# EAGLE design scd_v2 (EAGLE 8.4.3)
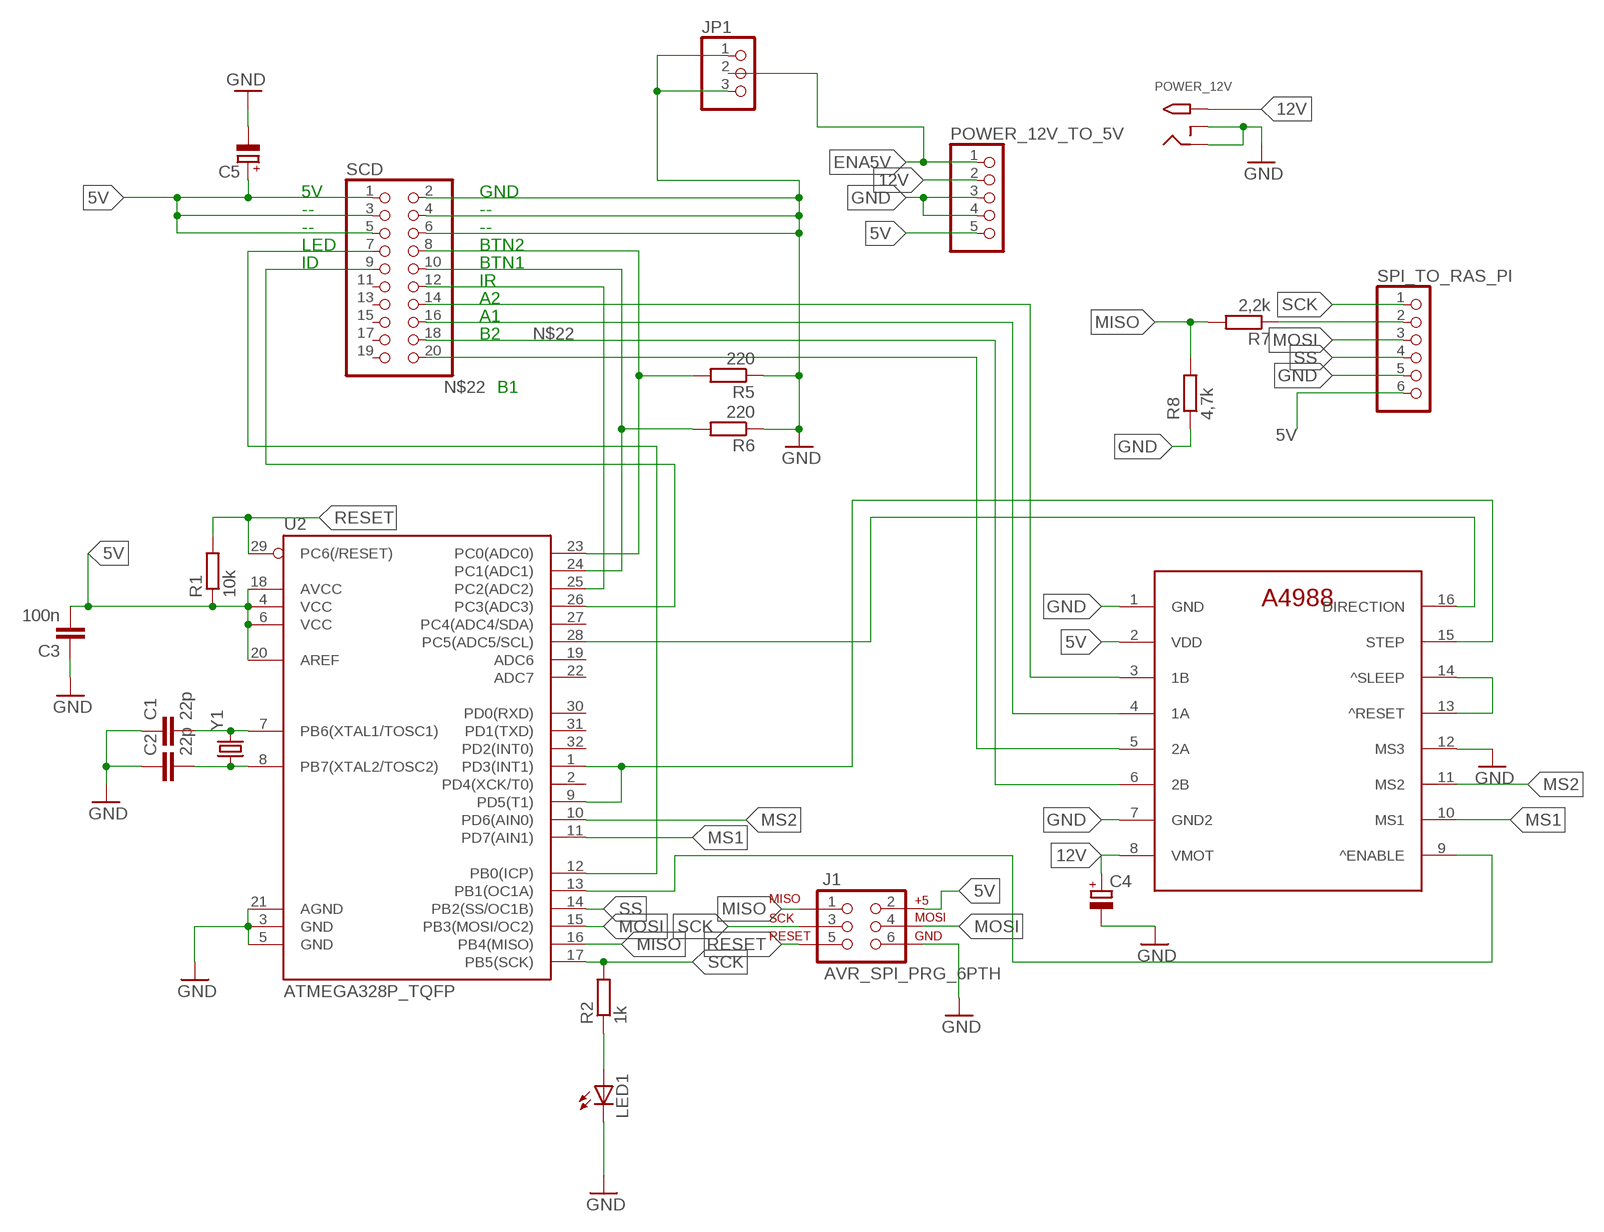
[diagram p0: schematic, sheet 1]

## Parts
C1  22p  C-EUC0805  [C0805]
C2  22p  C-EUC0805  [C0805]
C3  100n  C-EUC0805  [C0805]
C4  CPOL-EUTT2D7  [TT2D7]
C5  CPOL-EUTT2D7  [TT2D7]
J1  AVR_SPI_PRG_6PTH  [2X3]
JP1  PINHD-1X3/90  [1X03/90]
LED1  LEDCHIP-LED0805  [CHIP-LED0805]
POWER_12V  2.1MMJACKTHM  [PJ-102A]
POWER_12V_TO_5V  PINHD-1X5_2.54  [1X05]
R1  10k  R-EU_R0805  [R0805]
R2  1k  R-EU_R0805  [R0805]
R5  220  R-EU_R0805  [R0805]
R6  220  R-EU_R0805  [R0805]
R7  2,2k  R-EU_R0805  [R0805]
R8  4,7k  R-EU_R0805  [R0805]
SCD  PINHD-2X10_2.54  [2X10]
SPI_TO_RAS_PI  PINHD-1X6  [1X06]
U2  ATMEGA328P_TQFP  [TQFP32-08]
U$1  A4998_BREAKOUT  [A4988_BREAKOUT]
Y1  CRYSTALSMD  [HC49UP]

## Nets
5V: C3.2 C5.+ J1.2 POWER_12V_TO_5V.5 R1.1 SCD.1 SCD.3 SCD.5 SPI_TO_RAS_PI.6 U2.4(VCC) U2.6(VCC) U2.18(AVCC) U2.20(AREF) U$1.2(VDD)
12V: C4.+ POWER_12V.TIP POWER_12V_TO_5V.2 U$1.8(VMOT)
ENA5V: JP1.2 POWER_12V_TO_5V.1
GND: C1.1 C2.1 C3.1 C4.- C5.- J1.6 JP1.1 JP1.3 LED1.C POWER_12V.RING POWER_12V.RING_SW POWER_12V_TO_5V.3 POWER_12V_TO_5V.4 R5.1 R6.1 R8.1 SCD.2 SCD.4 SCD.6 SPI_TO_RAS_PI.5 U2.3(GND) U2.5(GND) U2.21(AGND) U$1.7(GND2) U$1.12(MS3)
MISO: J1.1 R7.2 R8.2 U2.16(PB4(MISO))
MOSI: J1.4 SPI_TO_RAS_PI.3 U2.15(PB3(MOSI/OC2))
MS1: U2.11(PD7(AIN1)) U$1.10(MS1)
MS2: U2.10(PD6(AIN0)) U$1.11(MS2)
N$1: SCD.20 U$1.5(2A)
N$2: R7.1 SPI_TO_RAS_PI.2
N$5: U2.1(PD3(INT1)) U2.9(PD5(T1)) U$1.15(STEP)
N$6: LED1.A R2.1
N$8: C1.2 U2.7(PB6(XTAL1/TOSC1)) Y1.2
N$9: C2.2 U2.8(PB7(XTAL2/TOSC2)) Y1.1
N$12: U2.13(PB1(OC1A)) U$1.9(^ENABLE)
N$13: SCD.7 U2.12(PB0(ICP))
N$14: U2.28(PC5(ADC5/SCL)) U$1.16(DIRECTION)
N$15: U$1.13(^RESET) U$1.14(^SLEEP)
N$16: R5.2 SCD.8 U2.23(PC0(ADC0))
N$17: R6.2 SCD.10 U2.24(PC1(ADC1))
N$18: SCD.12 U2.25(PC2(ADC2))
N$19: SCD.9 U2.26(PC3(ADC3))
N$20: SCD.14 U$1.3(1B)
N$21: SCD.16 U$1.4(1A)
N$22: SCD.18 U$1.6(2B)
RESET: J1.5 R1.2 U2.29(PC6(/RESET))
SCK: J1.3 R2.2 SPI_TO_RAS_PI.1 U2.17(PB5(SCK))
SS: SPI_TO_RAS_PI.4 U2.14(PB2(SS/OC1B))
Unconnected: SCD.11 SCD.13 SCD.15 SCD.17 SCD.19 U2.2(PD4(XCK/T0)) U2.19(ADC6) U2.22(ADC7) U2.27(PC4(ADC4/SDA)) U2.30(PD0(RXD)) U2.31(PD1(TXD)) U2.32(PD2(INT0)) U$1.1(GND)

## Notes on the sheet
- 5V | GND
- -- | --
- -- | --
- LED | BTN2
- ID | BTN1
- IR
- A2
- A1
- B2
- B1

## Library data of the parts
C1-C3 = rcl:C-EU: CAPACITOR, European symbol
C4 C5 = resistor:CPOL-EU: POLARIZED CAPACITOR, European symbol
J1 = SparkFun-Connectors:AVR_SPI_PRG_6: AVR ISP 6 Pin This is the reduced ISP connector for AVR programming. Common on Arduino. This footprint will take up less PCB space and can be used with a 10-pin to 6-pin adapter such as SKU: BOB-08508 **Special note about "TEST_POINT" package. The stop mask is on the top side, so if you want your programming test points to be on the bottom of your board, make sure to place this package on the bottom side of the board. This also ensure that the orientation to program from the bottom side will be correct.
JP1 = pinhead:PINHD-1X3: PIN HEADER
LED1 = adafruit:LED: LED OSRAM: - CHIPLED LG R971, LG N971, LY N971, LG Q971, LY Q971, LO R971, LY R971 LH N974, LH R974 LS Q976, LO Q976, LY Q976 LO Q996 - Hyper CHIPLED LW Q18S LB Q993, LB Q99A, LB R99A - SideLED LS A670, LO A670, LY A670, LG A670, LP A670 LB A673, LV A673, LT A673, LW A673 LH A674 LY A675 LS A676, LA A676, LO A676, LY A676, LW A676 LS A679, LY A679, LG A679 - Hyper Micro SIDELED® LS Y876, LA Y876, LO Y876, LY Y876 LT Y87S - SmartLED LW L88C, LW L88S LB L89C, LB L89S, LG L890 LS L89K, LO L89K, LY L89K LS L896, LA L896, LO L896, LY L896 - TOPLED LS T670, LO T670, LY T670, LG T670, LP T670 LSG T670, LSP T670, LSY T670, LOP T670, LYG T670 LG T671, LOG T671, LSG T671 LB T673, LV T673, LT T673, LW T673 LH T674 LS T676, LA T676, LO T676, LY T676, LB T676, LH T676, LSB T676, LW T676 LB T67C, LV T67C, LT T67C, LS T67K, LO T67K, LY T67K, LW E67C LS E67B, LA E67B, LO E67B, LY E67B, LB E67C, LV E67C, LT E67C LW T67C LS T679, LY T679, LG T679 LS T770, LO T770, LY T770, LG T770, LP T770 LB T773, LV T773, LT T773, LW T773 LH T774 LS E675, LA E675, LY E675, LS T675 LS T776, LA T776, LO T776, LY T776, LB T776 LHGB T686 LT T68C, LB T68C - Hyper Mini TOPLED® LB M676 - Mini TOPLED Santana® LG M470 LS M47K, LO M47K, LY M47K Source: http://www.osram.convergy.de/
POWER_12V = adafruit:2.1MMJACK: 2.1mm x 5.5mm THM DC jack with internal switch. Digikey part #PJ-102A, 4UCON part #05537 2.1mm x 5.5mm SMT DC jack with internal switch. Digikey part #PJ-002A-SMT, 4UCON part #03267 By microbuilder.eu & adafruit.com
POWER_12V_TO_5V = pinhead2:PINHD-1X5: PIN HEADER
R1 R2 R5-R8 = resistor:R-EU_: RESISTOR, European symbol
SCD = pinhead2:PINHD-2X10: PIN HEADER
SPI_TO_RAS_PI = adafruit:PINHD-1X6: PIN HEADER
U2 = SparkFun-DigitalIC:ATMEGA328P_TQFP; PROD_ID: IC-09069
U$1 = tim:A4998_BREAKOUT
Y1 = SparkFun-FreqCtrl:CRYSTAL: Various standard crystals. Proven footprints.

## Board
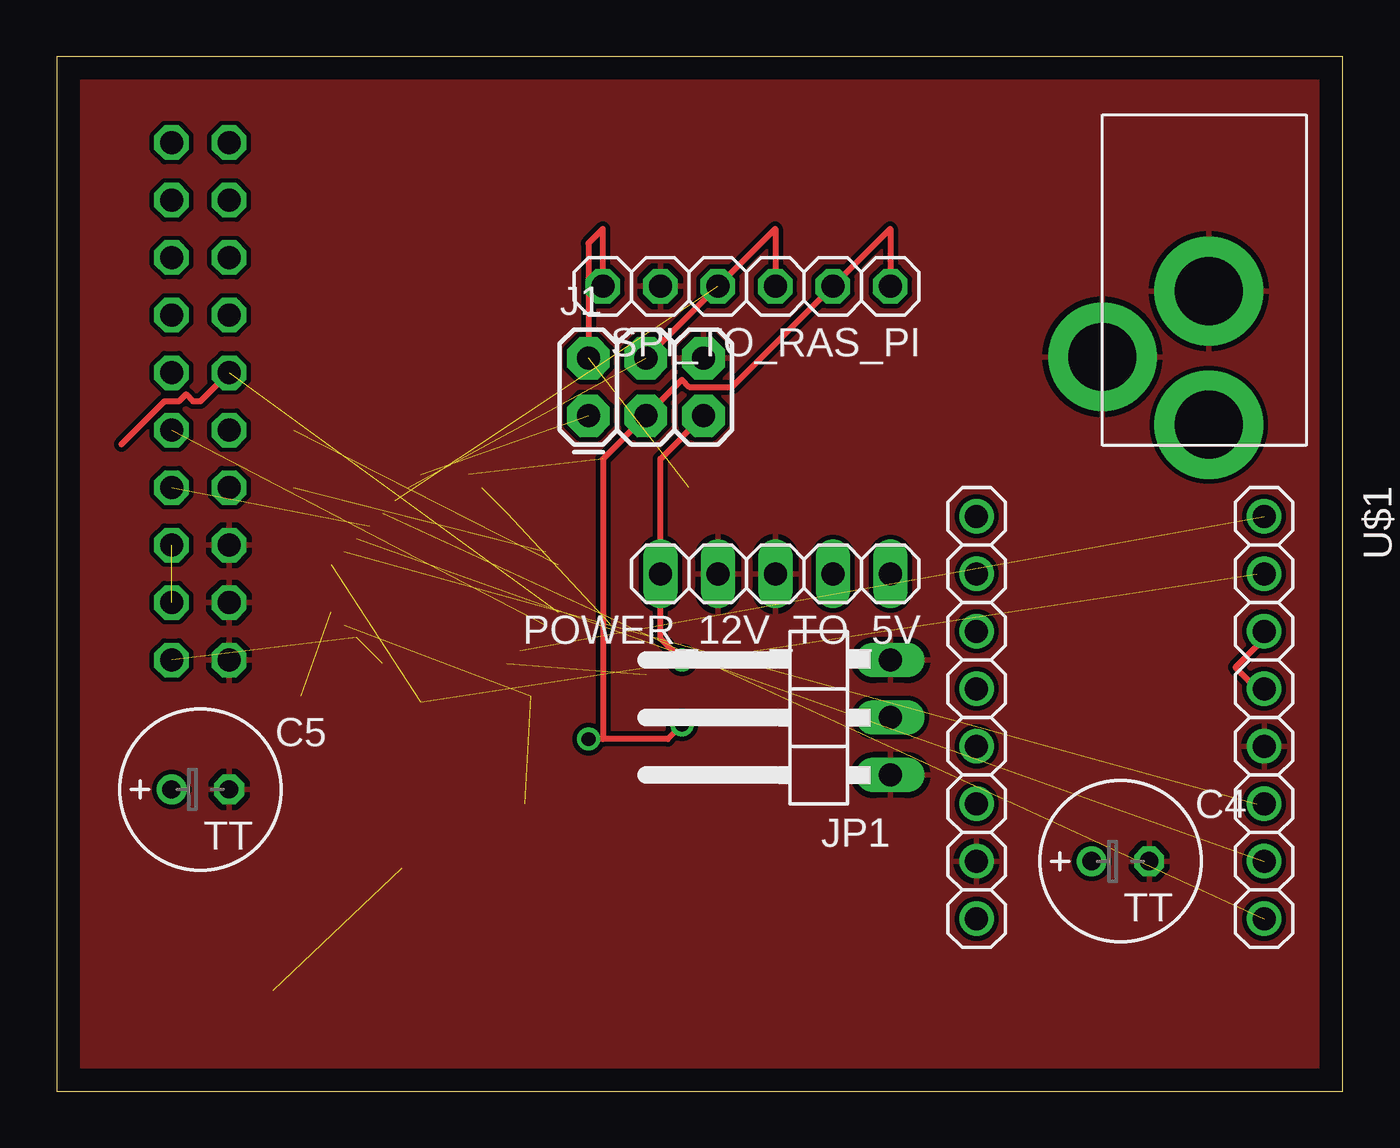
[diagram p1: board, top side]
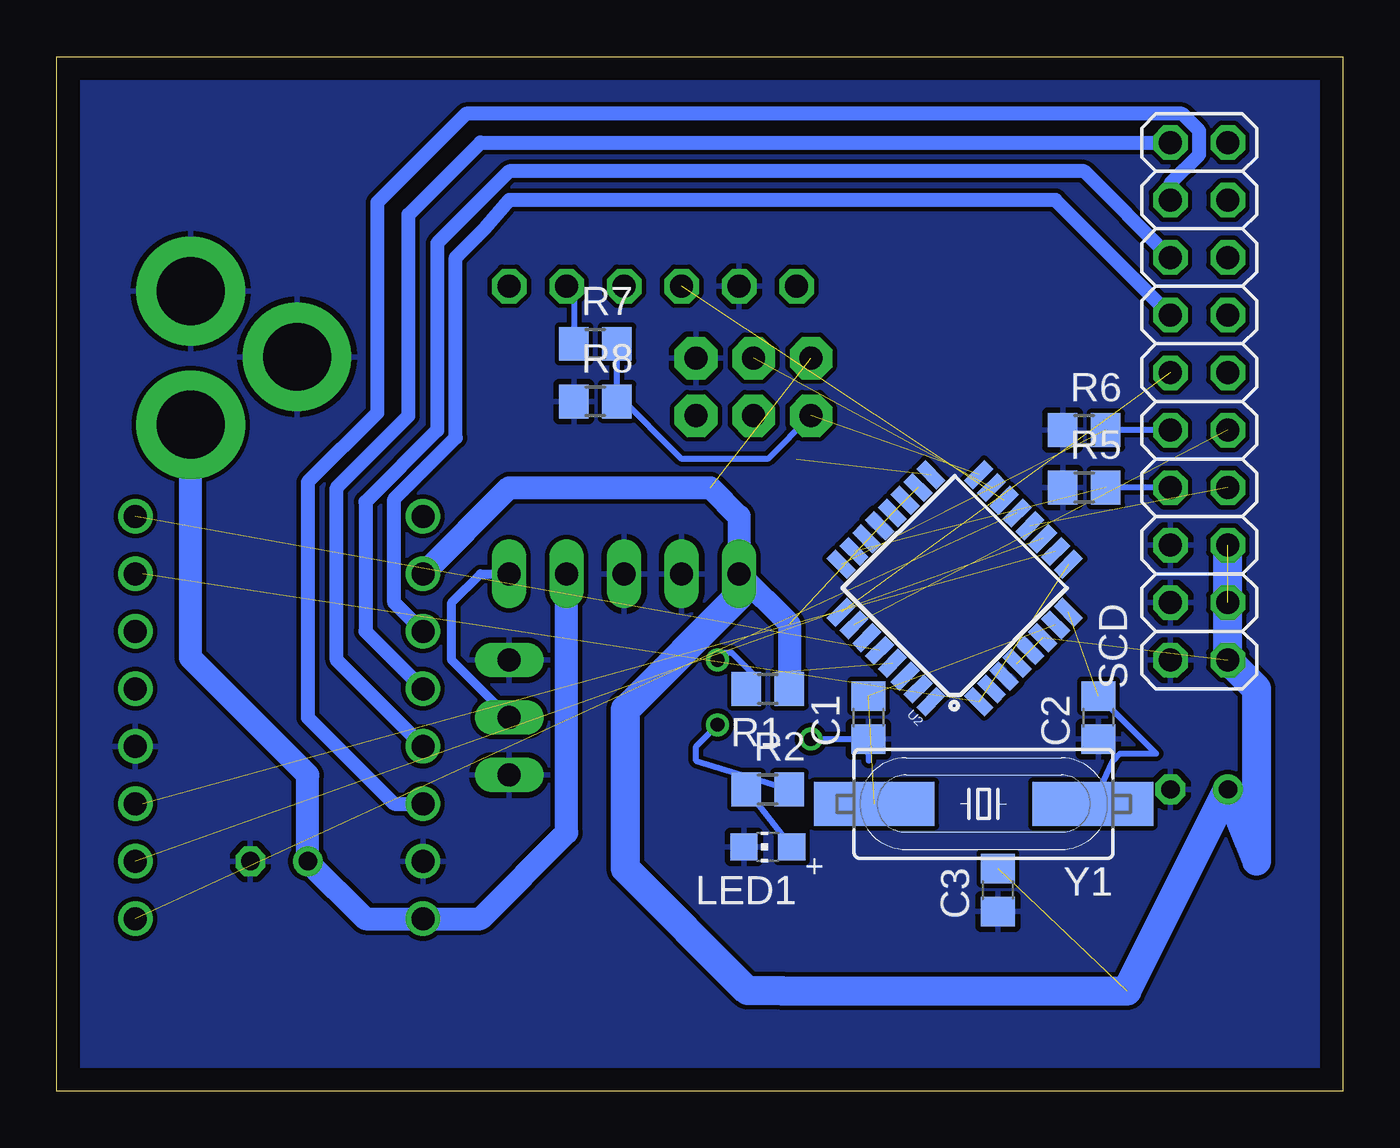
[diagram p2: board, bottom side, seen from below]

Size 56.82 x 45.71 mm. Coordinates in mm from the lower left corner, seen from the top.
Outline: 0,0 56.82,0 56.82,45.71 0,45.71 0,0
Copper layers (1*16): Top 0.035mm / dielectric 1.5mm / Bottom 0.035mm
Design rules "default": minimum track width 10mil, minimum drill 24mil, track to track 8mil, track to pad 8mil, pad to pad 8mil, via to via 8mil, smd to smd 8mil, copper to edge 40mil, drill to drill 8mil, minimum pad ring 10mil, minimum via ring 8mil, stop-mask expansion 4mil, vias tented up to drill 0mil, thermal gap 10mil

### Footprints (pad centres in the part's own frame; a part is rotated, then mirrored left to right if it is on the bottom)
C0805 = smd 1.3 x 1.5: 1 -0.95,0; 2 0.95,0
TT2D7 = drill 0.813: + -1.27,0 | drill 0.813 octagon: - 1.27,0
2X3 = drill 1.016 pad 1.88 octagon: 1 0,0; 2 0,2.54; 3 2.54,0; 4 2.54,2.54; 5 5.08,0; 6 5.08,2.54
1X03/90 = drill 1.016 long: 1 -2.54,-3.81; 2 0,-3.81; 3 2.54,-3.81
CHIP-LED0805 = smd 1.2 x 1.2: A 0,-1.05; C 0,1.05
PJ-102A = drill 3 pad 4.8: RING 0.1,-3.39; RING_SW -4.6,-6.29; TIP 0.1,-9.29
1X05 = drill 1.016 long: 1 -5.08,0; 2 -2.54,0; 3 0,0; 4 2.54,0; 5 5.08,0
R0805 = smd 1.3 x 1.5: 1 -0.95,0; 2 0.95,0
2X10 = drill 1.016 octagon: 1 -11.43,-1.27; 2 -11.43,1.27; 3 -8.89,-1.27; 4 -8.89,1.27; 5 -6.35,-1.27; 6 -6.35,1.27; 7 -3.81,-1.27; 8 -3.81,1.27; 9 -1.27,-1.27; 10 -1.27,1.27; 11 1.27,-1.27; 12 1.27,1.27; 13 3.81,-1.27; 14 3.81,1.27; 15 6.35,-1.27; 16 6.35,1.27; 17 8.89,-1.27; 18 8.89,1.27; 19 11.43,-1.27; 20 11.43,1.27
1X06 = drill 1.016 octagon: 1 -6.35,0; 2 -3.81,0; 3 -1.27,0; 4 1.27,0; 5 3.81,0; 6 6.35,0
TQFP32-08 = smd 1.27 x 0.559: 1 -4.293,2.8; 2 -4.293,2; 3 -4.293,1.2; 4 -4.293,0.4; 5 -4.293,-0.4; 6 -4.293,-1.2; 7 -4.293,-2; 8 -4.293,-2.8; 17 4.293,-2.8; 18 4.293,-2; 19 4.293,-1.2; 20 4.293,-0.4; 21 4.293,0.4; 22 4.293,1.2; 23 4.293,2; 24 4.293,2.8 | smd 0.559 x 1.27: 9 -2.8,-4.293; 10 -2,-4.293; 11 -1.2,-4.293; 12 -0.4,-4.293; 13 0.4,-4.293; 14 1.2,-4.293; 15 2,-4.293; 16 2.8,-4.293; 25 2.8,4.293; 26 2,4.293; 27 1.2,4.293; 28 0.4,4.293; 29 -0.4,4.293; 30 -1.2,4.293; 31 -2,4.293; 32 -2.8,4.293
A4988_BREAKOUT = drill 1.016: 1 1.27,-11.43; 2 3.81,-11.43; 3 6.35,-11.43; 4 8.89,-11.43; 5 11.43,-11.43; 6 13.97,-11.43; 7 16.51,-11.43; 8 19.05,-11.43; 9 19.05,1.27; 10 16.51,1.27; 11 13.97,1.27; 12 11.43,1.27; 13 8.89,1.27; 14 6.35,1.27; 15 3.81,1.27; 16 1.27,1.27
HC49UP = smd 5.334 x 1.93: 1 -4.826,0; 2 4.826,0

### Placement (x,y rotation side)
C1  20.95,16.51 90 bottom
C2  10.79,16.51 90 bottom
C3  15.24,8.89 90 bottom
C4  46.99,10.16 0 top
C5  6.35,13.33 0 top
J1  23.5,29.84 0 top
JP1  33.02,16.51 90 top
LED1  25.4,10.79 90 bottom
POWER_12V  50.8,38.73 0 top
POWER_12V_TO_5V  31.75,22.86 180 top
R1  25.4,17.78 180 bottom
R2  25.4,13.33 0 bottom
R5  11.43,26.67 0 bottom
R6  11.43,29.21 0 bottom
R7  33.02,33.02 0 bottom
R8  33.02,30.48 0 bottom
SCD  6.35,30.48 90 bottom
SPI_TO_RAS_PI  30.48,35.56 180 top
U2  17.14,22.23 135 bottom
U$1  52.07,26.67 270 top
Y1  15.88,12.7 180 bottom

### Tracks (layer width: path | path; a pad name or v marks a point on that pad's centre or on a via)
5V  (7 unrouted)
  Top 0.254: J1.2 23.5,37.46 24.13,38.1 SPI_TO_RAS_PI.6
  Bottom 1.016: U$1.2 36.83,26.67 27.94,26.67 26.67,25.4 POWER_12V_TO_5V.5 24.45,20.64 R1.1
  Bottom 1.27: SCD.5 SCD.1 3.81,17.78 3.81,10.16 C5.+ 9.54,4.43 22.94,4.43 24.86,4.45 | POWER_12V_TO_5V.5 26.67,21.91 31.7,16.88 31.7,9.85 26.3,4.45 24.86,4.45 | 24.77,4.45 24.86,4.45
12V
  Bottom 1.016: POWER_12V.TIP 50.9,19.15 45.72,13.97 C4.+ 43.18,7.62 U$1.8 38.1,7.62 34.29,11.43 POWER_12V_TO_5V.2
ENA5V
  Bottom 0.406: JP1.2 39.37,19.05 39.37,21.59 38.1,22.86 POWER_12V_TO_5V.1
GND
  pour Top: 0,45.72 58.42,45.72 58.42,0 0,0
  pour Bottom: 0,45.72 55.88,45.72 55.88,0 0,0
MISO  (1 unrouted)
  Bottom 0.254: R7.2 32.07,30.8 | 32.07,30.8 R8.2 | 32.07,30.8 29.21,27.94 25.4,27.94 J1.1
MOSI  (1 unrouted)
  Top 0.254: SPI_TO_RAS_PI.3 31.75,38.1 J1.4
MS1  (1 unrouted)
MS2  (1 unrouted)
  Bottom 0.254: 53.02,12.7 U$1.11
N$1
  Bottom 0.61: U$1.5 44.45,19.05 44.45,26.67 41.27,29.84 41.27,38.73 38.1,41.91 SCD.20
N$2
  Bottom 0.254: SPI_TO_RAS_PI.2 33.97,35.24 33.97,35.56 R7.1
N$5  (2 unrouted)
  Bottom 0.254: U$1.15 53.02,22.86
N$6
  Bottom 0.254: R2.1 LED1.A
N$8  (2 unrouted)
N$9  (1 unrouted)
  Bottom 0.254: C2.2 8.26,14.92 9.84,14.92 10.16,14.6 Y1.1
N$12  (1 unrouted)
N$13  (1 unrouted)
N$14  (1 unrouted)
N$15
  Top 0.254: U$1.13 53.02,17.78 52.07,18.73 53.34,20 U$1.14
N$16  (1 unrouted)
  Bottom 0.254: SCD.8 R5.2
N$17  (1 unrouted)
  Bottom 0.254: SCD.10 R6.2
N$18  (1 unrouted)
  Top 0.254: 2.86,28.57 4.76,30.48 5.4,30.48 5.71,30.8 6.03,30.48 6.35,30.48 SCD.12
N$19  (1 unrouted)
N$20
  Bottom 0.61: SCD.14 12.7,39.37 36.83,39.37 37.92,38.1 39.19,36.83 39.19,28.87 41.91,26.16 41.91,21.59 U$1.3
N$21
  Bottom 0.61: U$1.4 43.18,20.32 43.18,26.03 40.01,29.21 40.01,37.46 36.83,40.64 11.43,40.64 SCD.16
N$22
  Bottom 0.61: SCD.18 7.62,40.11 6.35,41.38 6.35,42.44 7.09,43.18 38.73,43.18 42.66,39.26 42.66,29.97 45.72,26.91 45.72,16.51 41.91,12.7 U$1.6
RESET  (via drill 0.61)  (1 unrouted)
  Top 0.254: J1.5 26.67,27.94 26.67,20 v27.62,19.05
  Bottom 0.254: v27.62,19.05 27.3,19.37 26.99,19.37 26.04,18.41 26.04,17.78 R1.2
SCK  (via drill 0.61)  (1 unrouted)
  Top 0.254: 24.13,15.56 26.99,15.56 v27.62,16.19 | 24.13,15.56 v23.5,15.56 | SPI_TO_RAS_PI.1 36.83,38.1 29.84,31.12 27.94,31.12 27.62,31.43 J1.3 24.13,27.94 24.13,15.56
  Bottom 0.254: 20.95,14.6 20.95,14.92 21.59,15.56 v23.5,15.56 | v27.62,16.19 28.57,15.24 28.57,14.6 R2.2
SS  (1 unrouted)